# EAGLE design CPLD (EAGLE 5.11)

## Sheet 1 of 3
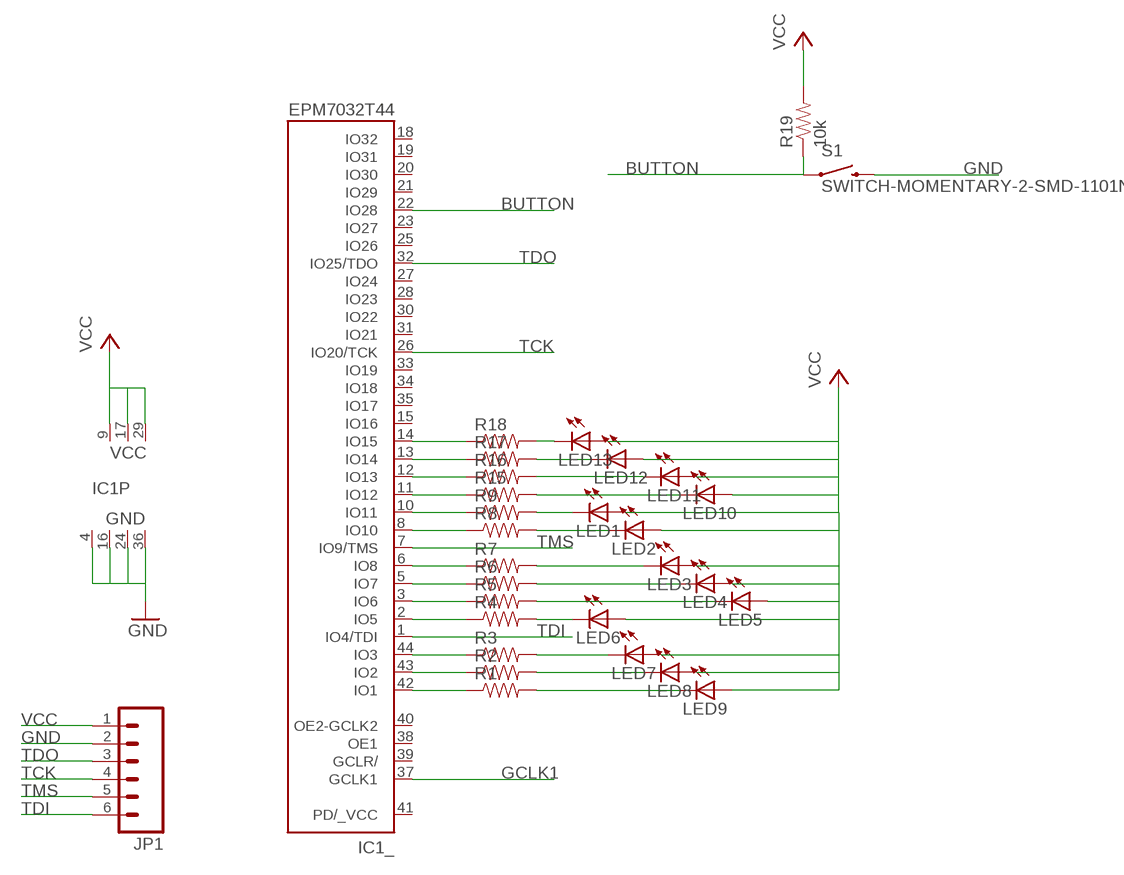
[diagram p0: schematic, sheet 1]

### Parts
IC1  EPM7032T44  [TQFP44]
JP1  M06SIP  [1X06]
LED1  LEDCHIPLED_1206  [CHIPLED_1206]
LED2  LEDCHIPLED_1206  [CHIPLED_1206]
LED3  LEDCHIPLED_1206  [CHIPLED_1206]
LED4  LEDCHIPLED_1206  [CHIPLED_1206]
LED5  LEDCHIPLED_1206  [CHIPLED_1206]
LED6  LEDCHIPLED_1206  [CHIPLED_1206]
LED7  LEDCHIPLED_1206  [CHIPLED_1206]
LED8  LEDCHIPLED_1206  [CHIPLED_1206]
LED9  LEDCHIPLED_1206  [CHIPLED_1206]
LED10  LEDCHIPLED_1206  [CHIPLED_1206]
LED11  LEDCHIPLED_1206  [CHIPLED_1206]
LED12  LEDCHIPLED_1206  [CHIPLED_1206]
LED13  LEDCHIPLED_1206  [CHIPLED_1206]
R1  RESISTOR  [0805]
R2  RESISTOR  [0805]
R3  RESISTOR  [0805]
R4  RESISTOR  [0805]
R5  RESISTOR  [0805]
R6  RESISTOR  [0805]
R7  RESISTOR  [0805]
R8  RESISTOR  [0805]
R9  RESISTOR  [0805]
R15  RESISTOR  [0805]
R16  RESISTOR  [0805]
R17  RESISTOR  [0805]
R18  RESISTOR  [0805]
R19  10k  RESISTOR  [0805]
S1  SWITCH-MOMENTARY-2-SMD-1101NE  [TACTILE-SWITCH-1101NE]

### Nets
BUTTON: IC1.22(_:IO28) R19.1 S1.P$1
GCLK1: IC1.37(_:GCLK1) ; also sheet 2
GND: IC1.4(P:GND) IC1.16(P:GND) IC1.24(P:GND) IC1.36(P:GND) JP1.2 S1.P$2 ; also sheet 2,3
N$1: IC1.13(_:IO14) R17.1
N$2: IC1.14(_:IO15) R18.1
N$3: IC1.12(_:IO13) R16.1
N$4: IC1.11(_:IO12) R15.1
N$5: IC1.10(_:IO11) R9.1
N$6: IC1.8(_:IO10) R8.1
N$7: IC1.6(_:IO8) R7.1
N$8: IC1.5(_:IO7) R6.1
N$9: IC1.3(_:IO6) R5.1
N$10: LED1.C R9.2
N$11: LED2.C R8.2
N$12: LED3.C R7.2
N$14: LED4.C R6.2
N$15: LED5.C R5.2
N$16: LED6.C R4.2
N$17: LED7.C R3.2
N$18: LED8.C R2.2
N$19: LED9.C R1.2
N$23: IC1.2(_:IO5) R4.1
N$24: IC1.44(_:IO3) R3.1
N$25: IC1.43(_:IO2) R2.1
N$26: IC1.42(_:IO1) R1.1
N$27: LED10.C R15.2
N$29: LED11.C R16.2
N$30: LED12.C R17.2
N$31: LED13.C R18.2
TCK: IC1.26(_:IO20/TCK) JP1.4
TDI: IC1.1(_:IO4/TDI) JP1.6
TDO: IC1.32(_:IO25/TDO) JP1.3
TMS: IC1.7(_:IO9/TMS) JP1.5
VCC: IC1.9(P:VCC) IC1.17(P:VCC) IC1.29(P:VCC) JP1.1 LED1.A LED2.A LED3.A LED4.A LED5.A LED6.A LED7.A LED8.A LED9.A LED10.A LED11.A LED12.A LED13.A R19.2 ; also sheet 2,3
Unconnected: IC1.15(_:IO16) IC1.18(_:IO32) IC1.19(_:IO31) IC1.20(_:IO30) IC1.21(_:IO29) IC1.23(_:IO27) IC1.25(_:IO26) IC1.27(_:IO24) IC1.28(_:IO23) IC1.30(_:IO22) IC1.31(_:IO21) IC1.33(_:IO19) IC1.34(_:IO18) IC1.35(_:IO17) IC1.38(_:OE1) IC1.39(_:GCLR/) IC1.40(_:OE2-GCLK2) IC1.41(_:PD/_VCC)

## Sheet 2 of 3
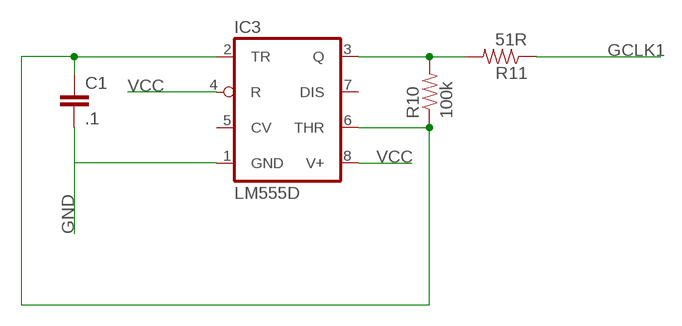
[diagram p1: schematic, sheet 2]

### Parts
C1  .1  CAP0805  [0805]
IC3  LM555D  [SO08]
R10  100k  RESISTOR  [0805]
R11  51R  RESISTOR  [0805]

### Nets
GCLK1: R11.1 ; also sheet 1
GND: C1.2 IC3.1(GND) ; also sheet 1,3
N$20: IC3.3(Q) R10.2 R11.2
N$22: C1.1 IC3.2(TR) IC3.6(THR) R10.1
VCC: IC3.4(R) IC3.8(V+) ; also sheet 1,3
Unconnected: IC3.5(CV) IC3.7(DIS)

## Sheet 3 of 3
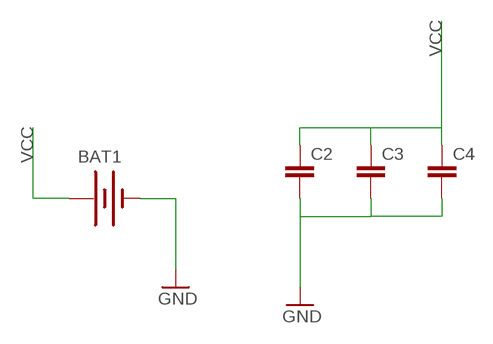
[diagram p2: schematic, sheet 3]

### Parts
BAT1  BATTERY20SMD  [BATTCON_20MM]
C2  CAP0805  [0805]
C3  CAP0805  [0805]
C4  CAP0805  [0805]

### Nets
GND: BAT1.2(-) C2.2 C3.2 C4.2 ; also sheet 1,2
VCC: BAT1.1(+) C2.1 C3.1 C4.1 ; also sheet 1,2

## Library data of the parts
BAT1 = SparkFun:BATTERY: Battery Holders Various common sizes : AA, AAA, 20mm coin cell and 12mm coin cell.
C1-C4 = SparkFun:CAP: Capacitor Standard 0603 ceramic capacitor, and 0.1" leaded capacitor.
IC1 = altera:EPM7032: EPM7032 MAX 7000 family; MPN: EPM7032SLC44-6N; OC_FARNELL: 1549447; OC_NEWARK: 51R9532
IC3 = linear:*555: TIMER
JP1 = SparkFun:M06: Header 6 Standard 6-pin 0.1" header. Use with straight break away headers (SKU : PRT-00116), right angle break away headers (PRT-00553), swiss pins (PRT-00743), machine pins (PRT-00117), and female headers (PRT-00115). Molex polarized connector foot print use with SKU : PRT-08094 with associated crimp pins and housings. NOTES ON THE VARIANTS LOCK and LOCK_LONGPADS... This footprint was designed to help hold the alignment of a through-hole component (i.e. 6-pin header) while soldering it into place. You may notice that each hole has been shifted either up or down by 0.005 of an inch from it's more standard position (which is a perfectly straight line). This slight alteration caused the pins (the squares in the middle) to touch the edges of the holes. Because they are alternating, it causes a "brace" to hold the component in place. 0.005 has proven to be the perfect amount of "off-center" position when using our standard breakaway headers. Although looks a little odd when you look at the bare footprint, once you have a header in there, the alteration is very hard to notice. Also, if you push a header all the way into place, it is covered up entirely on the bottom side. This idea of altering the position of holes to aid alignment will be further integrated into the Sparkfun Library for other footprints. It can help hold any component with 3 or more connection pins.
LED1-LED13 = led:LED: LED OSRAM: - CHIPLED LG R971, LG N971, LY N971, LG Q971, LY Q971, LO R971, LY R971 LH N974, LH R974 LS Q976, LO Q976, LY Q976 LO Q996 - Hyper CHIPLED LW Q18S LB Q993, LB Q99A, LB R99A - SideLED LS A670, LO A670, LY A670, LG A670, LP A670 LB A673, LV A673, LT A673, LW A673 LH A674 LY A675 LS A676, LA A676, LO A676, LY A676, LW A676 LS A679, LY A679, LG A679 - Hyper Micro SIDELED® LS Y876, LA Y876, LO Y876, LY Y876 LT Y87S - SmartLED LW L88C, LW L88S LB L89C, LB L89S, LG L890 LS L89K, LO L89K, LY L89K LS L896, LA L896, LO L896, LY L896 - TOPLED LS T670, LO T670, LY T670, LG T670, LP T670 LSG T670, LSP T670, LSY T670, LOP T670, LYG T670 LG T671, LOG T671, LSG T671 LB T673, LV T673, LT T673, LW T673 LH T674 LS T676, LA T676, LO T676, LY T676, LB T676, LH T676, LSB T676, LW T676 LB T67C, LV T67C, LT T67C, LS T67K, LO T67K, LY T67K, LW E67C LS E67B, LA E67B, LO E67B, LY E67B, LB E67C, LV E67C, LT E67C LW T67C LS T679, LY T679, LG T679 LS T770, LO T770, LY T770, LG T770, LP T770 LB T773, LV T773, LT T773, LW T773 LH T774 LS E675, LA E675, LY E675, LS T675 LS T776, LA T776, LO T776, LY T776, LB T776 LHGB T686 LT T68C, LB T68C - Hyper Mini TOPLED® LB M676 - Mini TOPLED Santana® LG M470 LS M47K, LO M47K, LY M47K Source: http://www.osram.convergy.de LUXEON: - LUMILED® LXK2-PW12-R00, LXK2-PW12-S00, LXK2-PW14-U00, LXK2-PW14-V00 LXK2-PM12-R00, LXK2-PM12-S00, LXK2-PM14-U00 LXK2-PE12-Q00, LXK2-PE12-R00, LXK2-PE12-S00, LXK2-PE14-T00, LXK2-PE14-U00 LXK2-PB12-K00, LXK2-PB12-L00, LXK2-PB12-M00, LXK2-PB14-N00, LXK2-PB14-P00, LXK2-PB14-Q00 LXK2-PR12-L00, LXK2-PR12-M00, LXK2-PR14-Q00, LXK2-PR14-R00 LXK2-PD12-Q00, LXK2-PD12-R00, LXK2-PD12-S00 LXK2-PH12-R00, LXK2-PH12-S00 LXK2-PL12-P00, LXK2-PL12-Q00, LXK2-PL12-R00 Source: www.luxeon.com KINGBRIGHT: KA-3528ASYC Source: www.kingbright.com
R1-R11 R15-R19 = TVbNull-Laser:RESISTOR: Resistor Basic schematic elements and footprints for 0603, 1206, and PTH 1/10th watt (small) resistors.
S1 = NSL_RFIDdle:SWITCH-MOMENTARY-2

## Board
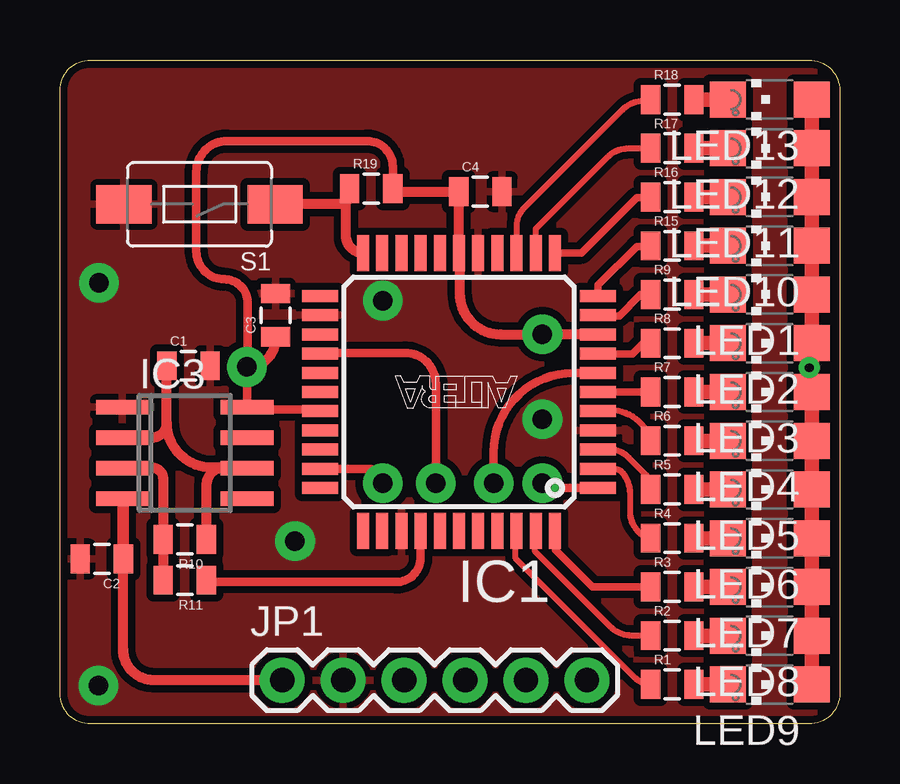
[diagram p3: board, top side]
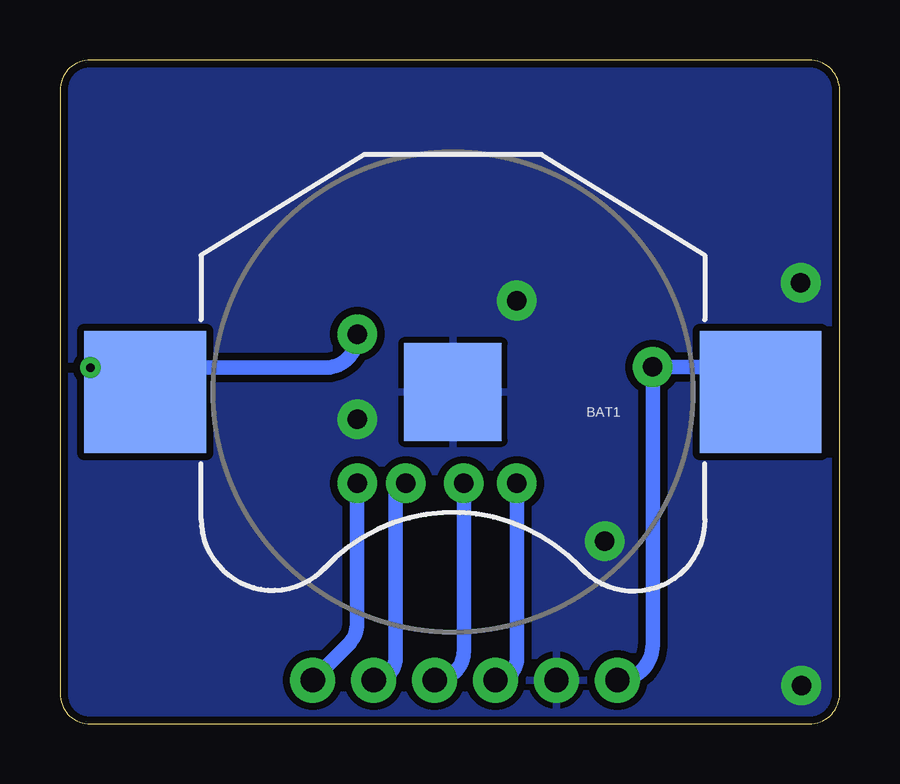
[diagram p4: board, bottom side, seen from below]

Size 32.51 x 27.69 mm. Coordinates in mm from the lower left corner, seen from the top.
Outline: 0,26.42 arc-90 1.27,27.69 31.24,27.69 arc-90 32.51,26.42 32.51,1.27 arc-90 31.24,0 1.27,0 arc-90 0,1.27 0,26.42
Copper layers (1*16): Top 0.0356mm / dielectric 1.5011mm / Bottom 0.0356mm
Design rules "SparkFun-mod": minimum track width 8mil, minimum drill 20mil, track to track 12mil, track to pad 12mil, pad to pad 8mil, via to via 8mil, smd to smd 8mil, copper to edge 12mil, drill to drill 8mil, minimum pad ring 12mil, minimum via ring 10mil, stop-mask expansion 4mil, vias tented up to drill 25mil, thermal gap 10mil

### Footprints (pad centres in the part's own frame; a part is rotated, then mirrored left to right if it is on the bottom)
BATTCON_20MM = smd 5.08 x 5.08: 1 -12.827,0; 3 12.827,0 | smd 4.064 x 4.064: 2 0,0
0805 = smd 0.8 x 1.2: 1 -0.9,0; 2 0.9,0
TQFP44 = smd 1.5 x 0.5: 1 -5.8,4; 2 -5.8,3.2; 3 -5.8,2.4; 4 -5.8,1.6; 5 -5.8,0.8; 6 -5.8,0; 7 -5.8,-0.8; 8 -5.8,-1.6; 9 -5.8,-2.4; 10 -5.8,-3.2; 11 -5.8,-4; 23 5.8,-4; 24 5.8,-3.2; 25 5.8,-2.4; 26 5.8,-1.6; 27 5.8,-0.8; 28 5.8,0; 29 5.8,0.8; 30 5.8,1.6; 31 5.8,2.4; 32 5.8,3.2; 33 5.8,4 | smd 0.5 x 1.5: 12 -4,-5.8; 13 -3.2,-5.8; 14 -2.4,-5.8; 15 -1.6,-5.8; 16 -0.8,-5.8; 17 0,-5.8; 18 0.8,-5.8; 19 1.6,-5.8; 20 2.4,-5.8; 21 3.2,-5.8; 22 4,-5.8; 34 4,5.8; 35 3.2,5.8; 36 2.4,5.8; 37 1.6,5.8; 38 0.8,5.8; 39 0,5.8; 40 -0.8,5.8; 41 -1.6,5.8; 42 -2.4,5.8; 43 -3.2,5.8; 44 -4,5.8
SO08 = smd 0.6 x 2.2: 1 -1.905,-2.6; 2 -0.635,-2.6; 3 0.635,-2.6; 4 1.905,-2.6; 5 1.905,2.6; 6 0.635,2.6; 7 -0.635,2.6; 8 -1.905,2.6
1X06 = drill 1.016 pad 1.88 round: 1 0,0; 2 2.54,0; 3 5.08,0; 4 7.62,0; 5 10.16,0; 6 12.7,0
CHIPLED_1206 = smd 1.5 x 1.5: A 0,-1.75; C 0,1.75
TACTILE-SWITCH-1101NE = smd 2.3 x 1.6: P$1 -3.15,0; P$2 3.15,0

### Placement (x,y rotation side)
BAT1  16.13,13.84 180 bottom
C1  5.36,14.94 0 top
C2  1.75,6.88 180 top
C3  8.99,17.04 90 top
C4  17.52,22.2 0 top
IC1  16.63,13.84 180 top
IC3  5.2,11.3 270 top
JP1  9.27,1.83 0 top
LED1  29.59,17.91 90 top
LED2  29.59,15.88 90 top
LED3  29.59,13.84 90 top
LED4  29.59,11.81 90 top
LED5  29.59,9.78 90 top
LED6  29.59,7.75 90 top
LED7  29.59,5.71 90 top
LED8  29.59,3.68 90 top
LED9  29.59,1.65 90 top
LED10  29.59,19.94 90 top
LED11  29.59,21.97 90 top
LED12  29.59,24 90 top
LED13  29.59,26.04 90 top
R1  25.52,1.65 0 top
R2  25.52,3.68 0 top
R3  25.52,5.71 0 top
R4  25.52,7.75 0 top
R5  25.52,9.78 0 top
R6  25.52,11.81 0 top
R7  25.52,13.84 0 top
R8  25.52,15.88 0 top
R9  25.52,17.91 0 top
R10  5.2,7.7 180 top
R11  5.2,5.99 180 top
R15  25.52,19.94 0 top
R16  25.52,21.97 0 top
R17  25.52,24 0 top
R18  25.52,26.04 0 top
R19  12.98,22.33 0 top
S1  5.81,21.67 180 top

### Tracks (layer width: path | path; a pad name or v marks a point on that pad's centre or on a via)
BUTTON
  Top 0.305: 11.92,21.54 arc90 11.8,21.67
  Top 0.356: 11.92,21.54 R19.1
  Top 0.406: 11.92,21.54 11.92,20.35 arc90 IC1.22 | 11.8,21.67 S1.P$1
GCLK1
  Top 0.305: IC1.37 arc90 IC1.37
  Top 0.356: IC1.37 15.03,6.93 arc-90 14.02,5.92 6.18,5.92 arc-90 R11.1
GND  (via drill 0.81 pad 1.65)
  other vias: 20.11,12.7 13.46,17.65 9.8,7.62 1.6,1.6 1.62,18.39
  pour Top (isolate 0.254): -0.97,28.68 33.17,28.68 33.17,-0.63 -0.97,-0.63
  pour Bottom (isolate 0.305): -1.32,28.85 32.81,28.85 32.81,-0.46 -1.32,-0.46
N$1
  Top 0.254: IC1.13 arc45 IC1.13 19.83,20.65 22.81,23.63 arc-45 23.71,24 R17.1
N$2
  Top 0.254: 19.02,19.66 arc45 19.05,19.72 19.05,20.78 arc-45 19.35,21.51 23.45,25.61 arc-45 24.35,25.98 24.5,25.98 arc45 R18.1
  Top 0.305: IC1.14 19.02,19.66
N$3
  Top 0.305: IC1.12 21.75,19.64 24.05,21.95 24.6,21.95 R16.1
N$4
  Top 0.305: IC1.11 22.43,18.3 24.05,19.91 24.6,19.91 R15.1
N$5
  Top 0.305: IC1.10 22.46,17.02 23.31,17.02 24.2,17.91 R9.1
N$6
  Top 0.305: IC1.8 22.46,15.42 23.87,15.42 24.33,15.88 R8.1
N$7
  Top 0.305: IC1.6 R7.1
N$8
  Top 0.254: 22.45,13.03 22.46,13.03 arc-90 R6.1
  Top 0.305: IC1.5 22.45,13.03
N$9
  Top 0.254: 22.45,11.43 arc-45 22.51,11.46 22.74,11.47 arc-49 23.72,11.1 24.45,10.37 arc-45 R5.1
  Top 0.305: 22.45,11.43 IC1.3 | R5.1 24.62,10.09
N$10
  Top 0.61: LED1.C R9.2
N$11
  Top 0.61: LED2.C R8.2
N$12
  Top 0.61: LED3.C R7.2
N$14
  Top 0.61: LED4.C R6.2
N$15
  Top 0.61: LED5.C R5.2
N$16
  Top 0.61: LED6.C R4.2
N$17
  Top 0.61: LED7.C R3.2
N$18
  Top 0.61: LED8.C R2.2
N$19
  Top 0.61: LED9.C R1.2
N$20
  Top 0.305: R10.2 arc-90 4.26,7.74
  Top 0.406: R11.2 R10.2 4.3,10.22 arc90 3.83,10.69 3.38,10.69 arc-90 3.35,10.67 IC3.3
N$22
  Top 0.406: IC3.2 3.83,11.94 arc90 4.46,12.56 | 4.46,12.56 C1.1 | IC3.6 arc90 7.78,10.69 6.86,10.69 | 6.86,10.69 6.33,10.69 arc-90 4.46,12.56 | 6.86,10.69 arc90 6.1,9.94 R10.1
N$23
  Top 0.254: IC1.2 arc45 22.5,10.62 23.19,10.62 arc-45 23.4,10.53 arc-45 23.77,9.63 23.77,8.88 arc45 24.14,7.99 24.21,7.92 arc45 R4.1
N$24
  Top 0.305: IC1.44 20.65,8.03 20.65,7.26 22.2,5.71 R3.1
N$25
  Top 0.254: IC1.43 arc45 19.81,7.98 19.81,7.19 22.94,4.05 arc45 23.84,3.68 R2.1
N$26
  Top 0.254: IC1.42 arc45 19,7.95 19,6.91 23.99,1.91 arc45 R1.1
  Top 0.305: R1.1 24.41,1.65
N$27
  Top 0.61: LED10.C R15.2
N$29
  Top 0.61: R16.2 LED11.C
N$30
  Top 0.61: LED12.C R17.2
N$31
  Top 0.61: R18.2 LED13.C
TCK  (via drill 0.81 pad 1.65)
  Top 0.305: IC1.26 arc-90 10.86,15.47
  Top 0.356: 10.86,15.47 14.4,15.47 arc-90 15.67,14.2 v15.67,10.03
  Bottom 0.61: JP1.4 arc-90 15.67,3.05 v15.67,10.03
TDI  (via drill 0.81 pad 1.65)
  Top 0.356: IC1.1 20.3,9.84 arc-90 v20.11,10.03
  Bottom 0.61: JP1.6 20.49,3.31 arc-45 20.11,4.21 v20.11,10.03
TDO  (via drill 0.81 pad 1.65)
  Top 0.305: IC1.32 arc-90 IC1.32
  Top 0.356: IC1.32 12.85,10.64 arc-90 v13.46,10.03
  Bottom 0.61: JP1.3 arc-90 13.46,2.72 v13.46,10.03
TMS  (via drill 0.81 pad 1.65)
  Top 0.305: 22.42,14.63 arc90 IC1.7
  Top 0.356: v18.08,10.03 18.08,11.33 arc-90 21.38,14.63 22.42,14.63
  Bottom 0.61: JP1.5 arc-90 18.51,2.74 18.51,9.75 18.36,9.75 arc-90 v18.08,10.03
VCC  (via drill 0.36, 0.81 pad 1.65)
  Top 0.254: v7.79,14.88 7.82,14.88
  Top 0.305: C2.1 arc90 2.61,6.85 | IC3.4 arc-90 2.65,9.35 | 7.91,13.11 arc-90 IC3.8 | IC1.29 arc90 10.77,13.11 | v7.8,14.88 arc90 v7.79,14.88 | 16.62,19.65 arc90 IC1.17 arc-90 16.66,19.62 | R19.2 arc90 14,22.2 | 22.42,16.26 arc-90 IC1.9
  Top 0.356: 10.77,13.11 7.91,13.11 | IC3.8 v7.8,14.88 | 7.82,14.88 7.82,17.58 arc90 6.86,18.54 arc-90 5.69,19.71 5.69,23.04 arc-90 6.96,24.31 12.8,24.31 arc-90 13.88,23.23 R19.2 | 8.99,16.05 C3.1
  Top 0.406: 16.62,19.65 C4.1 14,22.2 | 16.66,19.62 16.66,17.96 arc90 18.37,16.24 19.91,16.24 v20.11,16.26 22.42,16.26 | 7.82,14.88 arc90 8.99,16.05 | C2.1 2.65,9.35 arc90 IC3.4 arc-90 IC3.4 2.61,6.68 arc-90 2.64,6.66 2.64,3.1 arc90 3.91,1.83 JP1.1
  Top 0.61: LED13.A LED12.A LED11.A LED10.A LED1.A LED2.A 31.34,14.96 v31.24,14.86 31.24,13.94 LED3.A LED4.A LED5.A LED6.A LED7.A LED8.A LED9.A
  Bottom 0.305: 2.38,14.76 arc90 BAT1.1 arc-90 4.34,14.88
  Bottom 0.61: v31.24,14.86 21.37,14.86 arc-90 v20.11,16.26 | 4.34,14.88 v7.79,14.88 7.79,3.3 arc90 JP1.1